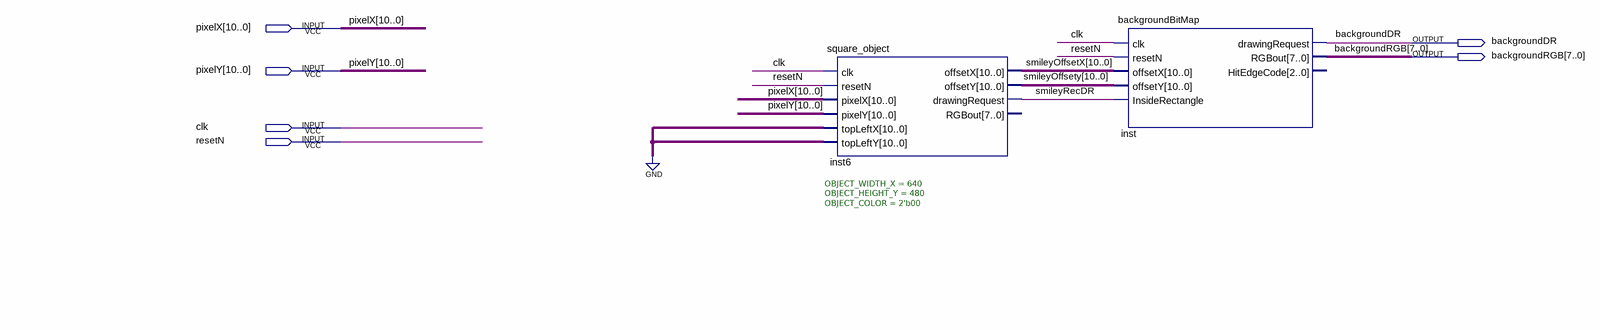
[diagram p0: schematic sheet]
// Quartus schematic BG_Block_T.bdf as structural Verilog: 2 symbols, 6 pins
module BG_Block_T (
  input  [10:0] pixelX,
  input  [10:0] pixelY,
  input  clk,
  input  resetN,
  output backgroundDR,
  output [7:0] backgroundRGB
);

  wire smileyRecDR;
  wire [10:0] smileyOffsetX, smileyOffsety;

  square_object #(.OBJECT_WIDTH_X(640), .OBJECT_HEIGHT_Y(480), .OBJECT_COLOR(2'b00)) inst6 (
    .clk(clk), .resetN(resetN), .pixelX(pixelX), .pixelY(pixelY), .topLeftX({11{1'b0}}),
    .topLeftY({11{1'b0}}), .offsetX(smileyOffsetX), .offsetY(smileyOffsety), .drawingRequest(smileyRecDR));  // open: RGBout
  backgroundBitMap inst (
    .clk(clk), .resetN(resetN), .offsetX(smileyOffsetX), .offsetY(smileyOffsety),
    .InsideRectangle(smileyRecDR), .drawingRequest(backgroundDR), .RGBout(backgroundRGB));  // open: HitEdgeCode
endmodule
